# Altium project UGS_System.PrjPcb
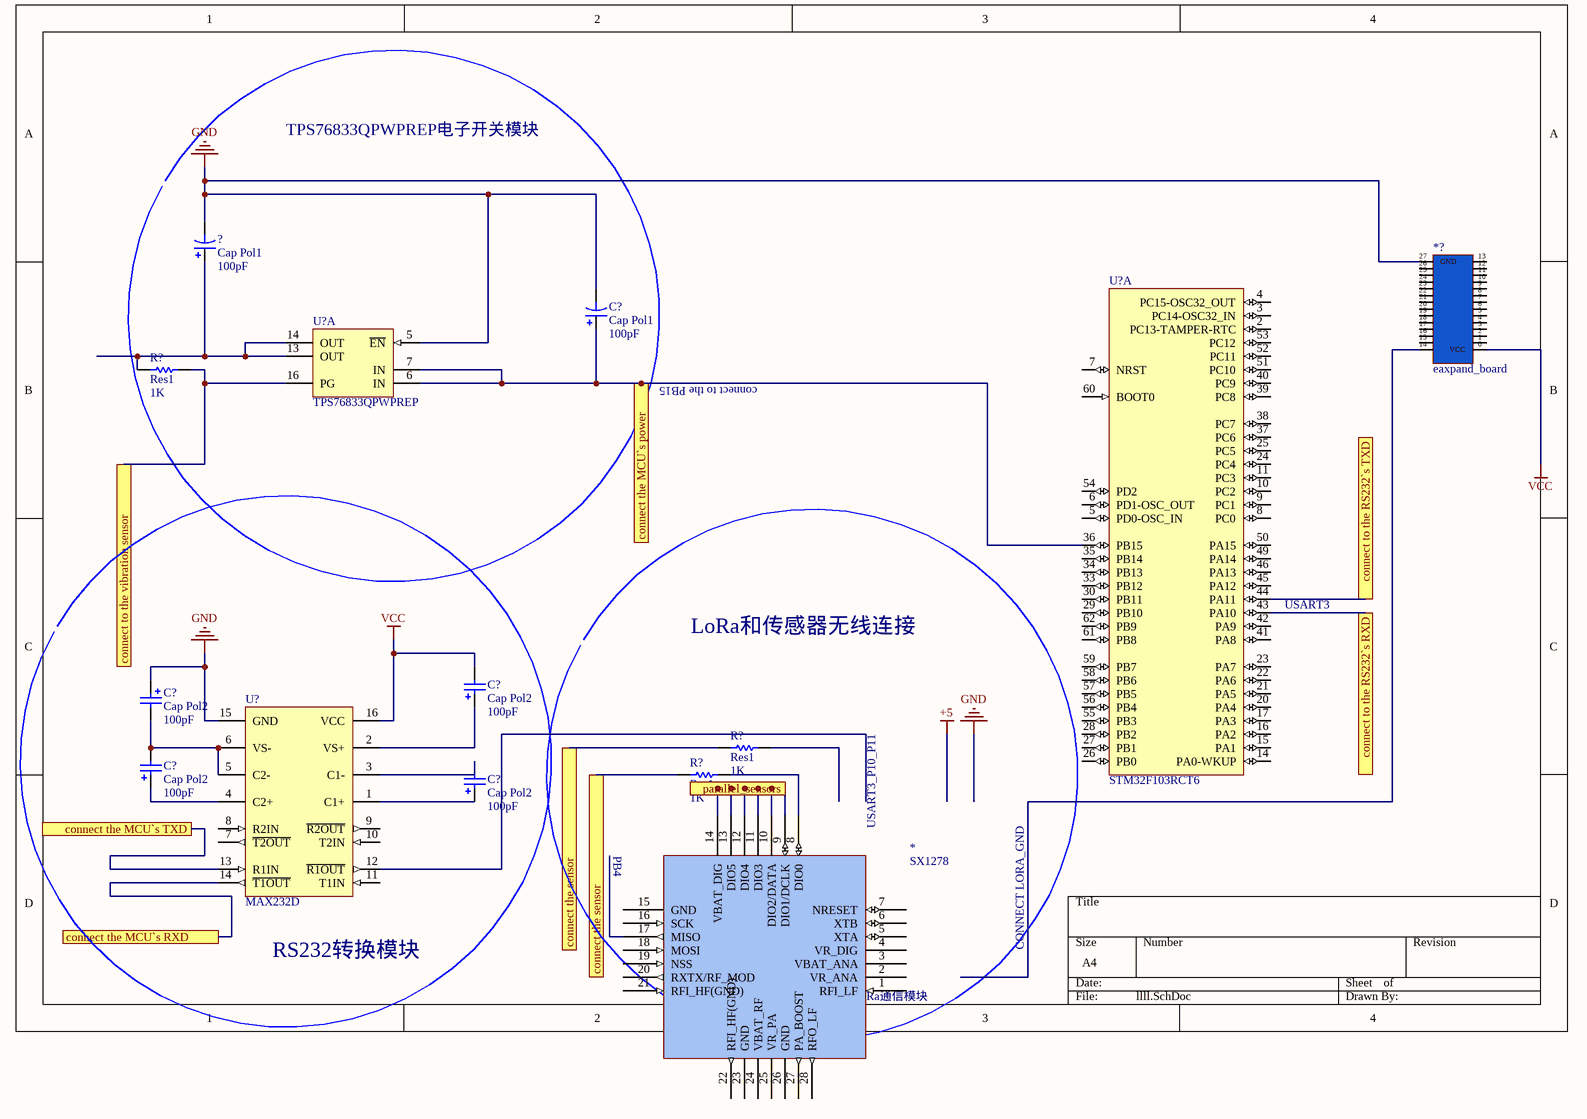
[diagram p0: llll.SchDoc]
2 sheets, 24 parts. Net scope: flat (ports and power ports of the same name join across sheets).
Board file: zhendong_sensor.PcbDoc
Sheets:
  llll.SchDoc
  transform.SchDoc

## Sheet llll.SchDoc
size A4

### Parts
(Parts that share a designator on the sheet are numbered #1, #2 ... from top to bottom, then left to right.)
*  SX1278
*?  eaxpand_board  [expand_board]
?  Cap Pol1  value 100pF  [RB7.6-15]
C?#1  Cap Pol1  value 100pF  [RB7.6-15]
C?#2  Cap Pol2  value 100pF  [POLAR0.8]
C?#3  Cap Pol2  value 100pF  [POLAR0.8]
C?#4  Cap Pol2  value 100pF  [POLAR0.8]
C?#5  Cap Pol2  value 100pF  [POLAR0.8]
R?#1  Res1  value 1K  [AXIAL-0.3]
R?#2  Res1  value 1K  [AXIAL-0.3]
R?#3  Res1  value 1K  [AXIAL-0.3]
U?#1  TPS76833QPWPREP  [TI-PWP20-2980X2000TP_N]  (part A of 3)
U?#2  STM32F103RCT6  [STM-LQFP64_N]  (part A of 2)
U?#3  MAX232D  [TI-D16_N]

### Ports
connect the MCU`s power, connect the MCU`s RXD, connect the MCU`s TXD, connect the sensor, connect to the RS232`s RXD, connect to the RS232`s TXD, connect to the vibration sensor, parallel_sensors

### Nets
GND: *?.27(GND) ?.2 C?#1.2 C?#2.1 U?#1.5(~{EN}) U?#3.15(GND)
VCC: *?.0(VCC) C?#3.2 U?#3.16(VCC)
Net*_8: *.8(DIO0) R?#3.2
Net*_9: *.9(DIO1/DCLK) ; port parallel_sensors
Net?_1: ?.1 R?#1.1 U?#1.13(OUT) U?#1.14(OUT)
NetC?#1_1: C?#1.1 U?#1.6(IN) U?#1.7(IN) U?#2.36(PB15) ; port connect the MCU`s power
NetC?#2_2: C?#2.2 C?#4.2 U?#3.5(C2-) U?#3.6(VS-)
NetC?#3_1: C?#3.1 U?#3.2(VS+)
NetC?#4_1: C?#4.1 U?#3.4(C2+)
NetC?#5_1: C?#5.1 U?#3.1(C1+)
NetC?#5_2: C?#5.2 U?#3.3(C1-)
NetR?#1_2: R?#1.2 U?#1.16(PG) ; port connect to the vibration sensor
NetR?#2_1: R?#2.1 R?#3.1 ; port connect the sensor
NetU?#2_43: U?#2.43(PA10) ; port connect to the RS232`s RXD
NetU?#2_44: U?#2.44(PA11) ; port connect to the RS232`s TXD
NetU?#3_13: U?#3.13(R1IN) ; port connect the MCU`s TXD
NetU?#3_14: U?#3.14(~{T1OUT}) ; port connect the MCU`s RXD

Not connected (* = marked no-connect by the designer): * 1(RFI_LF) 2(VR_ANA) 3(VBAT_ANA) 4(VR_DIG) 5(XTA) 6(XTB) 7(NRESET) 10(DIO2/DATA) 11(DIO3) 12(DIO4) 13(DIO5) 14(VBAT_DIG) 15(GND) 16(SCK) 17(MISO) 18(MOSI) 19(NSS) 20(RXTX/RF_MOD) 21(RFI_HF(GND)) 22(RFI_HF(GND)) 23(GND) 24(VBAT_RF) 25(VR_PA) 26(GND) 27(PA_BOOST) 28(RFO_LF); *? 1 2 3 4 5(\) 6 7 8 9 10 11 12 13 14 15 16 17 18 19 20 21 22 23 24 25 26; R?#2 2; U?#2 2(PC13-TAMPER-RTC) 3(PC14-OSC32_IN) 4(PC15-OSC32_OUT) 5(PD0-OSC_IN) 6(PD1-OSC_OUT) 7(NRST) 8(PC0) 9(PC1) 10(PC2) 11(PC3) 14(PA0-WKUP) 15(PA1) 16(PA2) 17(PA3) 20(PA4) 21(PA5) 22(PA6) 23(PA7) 24(PC4) 25(PC5) 26(PB0) 27(PB1) 28(PB2) 29(PB10) 30(PB11) 33(PB12) 34(PB13) 35(PB14) 37(PC6) 38(PC7) 39(PC8) 40(PC9) 41(PA8) 42(PA9) 45(PA12) 46(PA13) 49(PA14) 50(PA15) 51(PC10) 52(PC11) 53(PC12) 54(PD2) 55(PB3) 56(PB4) 57(PB5) 58(PB6) 59(PB7) 60(BOOT0) 61(PB8) 62(PB9); U?#3 7(~{T2OUT}) 8(R2IN) 9(~{R2OUT}) 10(T2IN) 11(T1IN) 12(~{R1OUT})

### Notes on the sheet
- TPS76833QPWPREP电子开关模块
- connect to the PB15
- LoRa和传感器无线连接
- (near U?#2) USART3
- (near *) PB4
- (near *) USART3_P10_P11
- RS232转换模块
- CONNECT LORA_GND
- (near *) LoRa通信模块

### Library data of the parts
* = SX1278: LORA
? C?#1 = Cap Pol1: Polarized Capacitor (Radial); Published: 8-Jun-2000; LatestRevisionDate: 17-Jul-2002; LatestRevisionNote: Re-released for DXP Platform.; PackageReference: RB7.6-15; Publisher: Altium Limited; PackageDescription: Polarized Capacitor (Radial); 2 Leads
C?#2-C?#5 = Cap Pol2: Polarized Capacitor (Axial); Published: 8-Jun-2000; LatestRevisionDate: 17-Jul-2002; LatestRevisionNote: Re-released for DXP Platform.; PackageReference: POLAR0.8; Publisher: Altium Limited; PackageDescription: Polarized Capacitor; 2 Leads
R?#1-R?#3 = Res1: Resistor; Published: 8-Jun-2000; LatestRevisionDate: 17-Jul-2002; LatestRevisionNote: Re-released for DXP Platform.; PackageReference: AXIAL-0.3; Publisher: Altium Limited; PackageDescription: Axial Device, Thru-Hole; 2 Leads; 0.3 in Pin Spacing
U?#1 = TPS76833QPWPREP: Single Output Fast Transient Response LDO, 1 A, Fixed 3.3 V Output, 2.7 to 10 V Input, 20-pin HTSSOP (PWP), -40 to 125 degC, Green (RoHS & no Sb/Br); Manufacturer: Texas Instruments; Accuracy(%): 2; Fixed Output Options(V): 3.3; Iout(Max)(A): 1; Iq(Typ)(mA): 0.08; Power Good: TRUE; SubFamily: Single Channel LDO; Vdo(Typ)(mV): 350; Vin(Max)(V): 10; Vin(Min)(V): 2.7; DatasheetVersion: SGLS011B; PackageVersion: 4073225-4/I; PackageReference: PWP20-2980X2000TP; PackageDescription: 20-Pin Plastic Small Outline, Body 4.4 x 6.5 mm, Pitch 0.65 mm; Supplier 1: Digi-Key; Supplier Part Number 1: 296-21901-2-ND; Supplier 2: Digi-Key; Supplier Part Number 2: 296-21901-1-ND; Supplier 3: Digi-Key; Supplier Part Number 3: 296-21901-6-ND; Supplier 4: Newark; Supplier Part Number 4: 46M1185; Supplier 5: Mouser; Supplier Part Number 5: 595-TPS76833QPWPREP; Eco-Plan: Green (RoHS & no Sb/Br); Vout Adj(Max)(V): 3.3; Vout Adj(Min)(V): 3.3; Mounting Technology: Surface Mount; Code_JEDEC: MO-153; PartNumber: TPS76833QPWPREP; ComponentLink1Description: Manufacturer URL; ComponentLink1URL: http://www.ti.com/; ComponentLink2Description: Datasheet; ComponentLink2URL: http://www.ti.com/general/docs/lit/getliterature.tsp?genericPartNumber=TPS76833-EP&fileType=pdf; ComponentLink3Description: Package Specification; ComponentLink3URL: http://www.ti.com/litv/pdf/mhts001g
U?#2 = STM32F103RCT6: ARM Cortex-M3 32-bit MCU, 256 KB Flash, 48 KB Internal RAM, 51 I/Os, 64-pin LQFP, -40 to 85 degC, Tray; A/D Converter: 3x12-bit (16 Channel); D/A Converter: 2x12-bit (2 Channel); FLASH Size (Prog) (kB): 256; I/Os (High Current): 51; Internal RAM Size (kB): 48; Operating Frequency(F) (Processor speed) (MHz): 72; Supply Voltage(Vcc) min (V): 2; DatasheetVersion: Rev. 8; PackageVersion: Rev. 4, 06/2013; PackageReference: LQFP64; PackageDescription: 64-Pin Low Profile Quad Flat Package, 10 x 10 mm Body, 0.5 mm Pitch; Supplier 1: Digi-Key; Supplier Part Number 1: 497-9033-ND; Supplier 2: Newark; Supplier Part Number 2: 01P4099; Supplier 3: Newark; Supplier Part Number 3: 57P1227; Supplier 4: Mouser; Supplier Part Number 4: 511-STM32F103RCT6; Core: ARM Cortex-M3; Packing: Tray; Mounting Technology: Surface Mount; PartNumber: STM32F103RCT6; ComponentLink1Description: Manufacturer URL; ComponentLink1URL: http://www.st.com/web/en/home.html; ComponentLink2Description: Datasheet; ComponentLink2URL: http://www.st.com/st-web-ui/static/active/en/resource/technical/document/datasheet/CD00191185.pdf; ComponentLink3Description: Package Specification; ComponentLink3URL: http://www.st.com/st-web-ui/static/active/en/resource/technical/document/datasheet/DM00037051.pdf
U?#3 = MAX232D: Dual EIA-232 Driver / Receiver, 0 to 70 degC, 16-Pin SOIC (D), Green (RoHS & no Sb/Br); SubFamily: RS-232; Drivers Per Package: 2; Supply Voltage(s)(V): 5; ESD HBM(kV): +/-2; ICC(Max)(mA): 10; Single Supply: TRUE; DatasheetVersion: SLLS047L; PackageVersion: revM, Jun-2011; PackageReference: D16; PackageDescription: 16-Pin Plastic Small Outline Integrated Circuit, 9.9 x 3.9 mm, Pitch 1.27 mm Pitch; Receivers Per Package: 2; RS-232: TRUE; ComponentLink1Description: Manufacturer URL; ComponentLink1URL: www.ti.com; ComponentLink2Description: Datasheet; ComponentLink2URL: http://www.ti.com/general/docs/lit/getliterature.tsp?genericPartNumber=MAX232&fileType=pdf; ComponentLink3Description: Package Specification; ComponentLink3URL: http://www.ti.com/litv/pdf/mpds178g

## Sheet transform.SchDoc
size A4
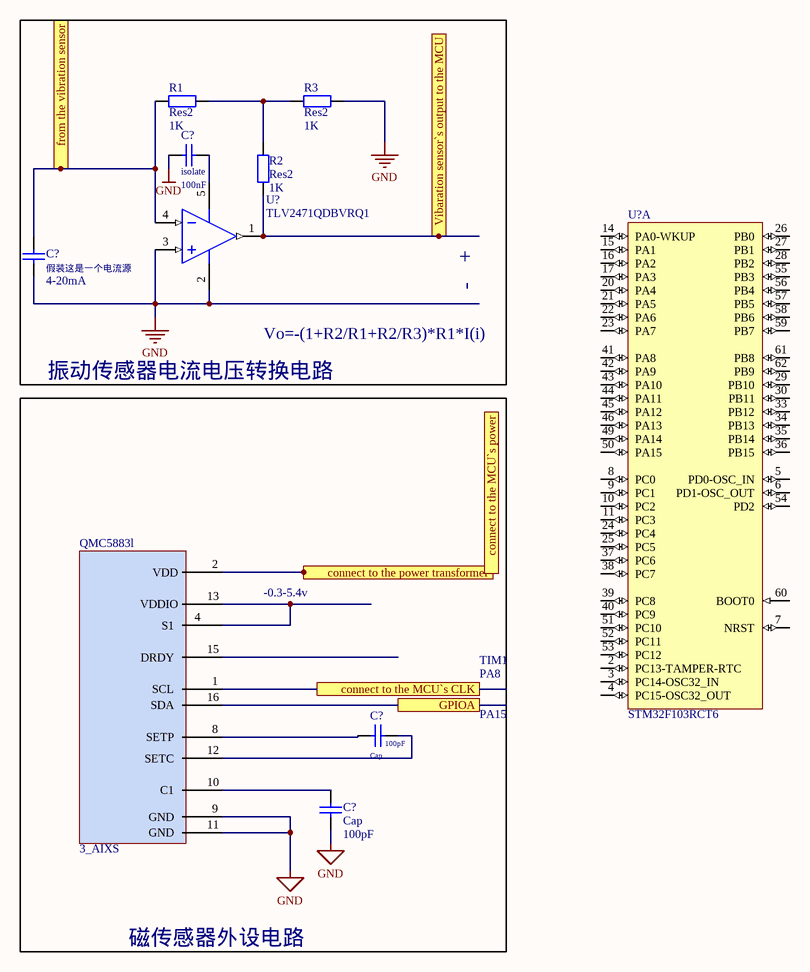
[diagram p1: transform.SchDoc]

### Parts
(Parts that share a designator on the sheet are numbered #1, #2 ... from top to bottom, then left to right.)
C?#6  isolate  value 100nF  [RAD-0.3]
C?#7  假装这是一个电流源  value 4-20mA  [RAD-0.3]
C?#8  Cap  value 100pF  [RAD-0.3]
C?#9  Cap  value 100pF  [RAD-0.3]
QMC5883l  3_AIXS
R1  Res2  value 1K  [AXIAL-0.4]
R2  Res2  value 1K  [AXIAL-0.4]
R3  Res2  value 1K  [AXIAL-0.4]
U?#4  TLV2471QDBVRQ1  [TI-DBV5_N]
U?#5  STM32F103RCT6  [STM-LQFP64_N]  (part A of 2)

### Ports
connect to the MCU`s CLK, connect to the MCU`s power, connect to the power transformer, from the vibration sensor, GPIOA, Vibaration sensor`s output to the MCU

### Nets
GND: C?#6.2 C?#7.1 C?#9.1 QMC5883l.9(GND) QMC5883l.11(GND) R3.1 U?#4.2(GND) U?#4.3(IN+)
NetC?#6_1: C?#6.1 U?#4.5(VDD)
NetC?#7_2: C?#7.2 R1.1 U?#4.4(IN-) ; port from the vibration sensor
NetC?#8_1: C?#8.1 QMC5883l.12(SETC)
NetC?#8_2: C?#8.2 QMC5883l.8(SETP)
NetC?#9_2: C?#9.2 QMC5883l.10(C1)
NetQMC5883l_1: QMC5883l.1(SCL) ; port connect to the MCU`s CLK
NetQMC5883l_2: QMC5883l.2(VDD) ; port connect to the power transformer
NetQMC5883l_4: QMC5883l.4(S1) QMC5883l.13(VDDIO)
NetQMC5883l_16: QMC5883l.16(SDA) ; port GPIOA
NetR1_2: R1.2 R2.2 R3.2
NetR2_1: R2.1 U?#4.1(OUT) ; port Vibaration sensor`s output to the MCU

Not connected (* = marked no-connect by the designer): QMC5883l 15(DRDY); U?#5 2(PC13-TAMPER-RTC) 3(PC14-OSC32_IN) 4(PC15-OSC32_OUT) 5(PD0-OSC_IN) 6(PD1-OSC_OUT) 7(NRST) 8(PC0) 9(PC1) 10(PC2) 11(PC3) 14(PA0-WKUP) 15(PA1) 16(PA2) 17(PA3) 20(PA4) 21(PA5) 22(PA6) 23(PA7) 24(PC4) 25(PC5) 26(PB0) 27(PB1) 28(PB2) 29(PB10) 30(PB11) 33(PB12) 34(PB13) 35(PB14) 36(PB15) 37(PC6) 38(PC7) 39(PC8) 40(PC9) 41(PA8) 42(PA9) 43(PA10) 44(PA11) 45(PA12) 46(PA13) 49(PA14) 50(PA15) 51(PC10) 52(PC11) 53(PC12) 54(PD2) 55(PB3) 56(PB4) 57(PB5) 58(PB6) 59(PB7) 60(BOOT0) 61(PB8) 62(PB9)

### Notes on the sheet
- +
- -
- Vo=-(1+R2/R1+R2/R3)*R1*I(i)
- 振动传感器电流电压转换电路
- -0.3-5.4v
- TIM1
- PA8
- PA15
- 磁传感器外设电路

### Library data of the parts
C?#6-C?#9 = Cap: Capacitor; Published: 8-Jun-2000; LatestRevisionDate: 17-Jul-2002; LatestRevisionNote: Re-released for DXP Platform.; PackageReference: RAD-0.3; Publisher: Altium Limited; PackageDescription: Radial Cap, Thru-Hole; 2 Leads; 0.3 in Pin Spacing
QMC5883l = QMC5883L
R1-R3 = Res2: Resistor; Published: 8-Jun-2000; LatestRevisionDate: 17-Jul-2002; LatestRevisionNote: Re-released for DXP Platform.; PackageReference: AXIAL-0.4; Publisher: Altium Limited; PackageDescription: Axial Device, Thru-Hole; 2 Leads; 0.4 in Pin Spacing
U?#4 = TLV2471QDBVRQ1: Automotive Catalog 600 uA/Ch 2.8 MHz Rail-to-Rail Input / Output High-Drive Operational Amplifier, 2.7 to 6 V, -40 to 125 degC, 5-pin SOT23 (DBV5), Green (RoHS & no Sb/Br); Manufacturer: Texas Instruments; CMRR(Min)(dB): 58; GBW(Typ)(MHz): 2.8; IIB(Max)(pA): 50; Iq per channel(Max)(mA): 0.75; Number of Channels: 1; Offset Drift(Typ)(uV/C): 0.4; Packing: LARGE T&R; Slew Rate(Typ)(V/us): 1.4; Sub Family: Low Supply Voltage Amplifier (<=2.7V), Precision Amplifier; Total Supply Voltage(Max)(+5V is 5, +/-5V is 10): 6; Total Supply Voltage(Min)(+5V is 5, +/-5V is 10): 2.7; Vio (25C)(Max)(mV): 2.2; DatasheetVersion: SGLS180B; PackageVersion: 4073253-4/K, 03/2006; PackageReference: DBV5; PackageDescription: 5-Pin Plastic Small Outline, Body 1.6 x 2.9 mm, Pitch 0.95 mm; Eco-Plan: Green (RoHS & no Sb/Br); Rating: Automotive; Mounting Technology: Surface Mount; Code_JEDEC: MO-178; PartNumber: TLV2471QDBVRQ1; ComponentLink1Description: Manufacturer URL; ComponentLink1URL: http://www.ti.com/; ComponentLink2Description: Datasheet; ComponentLink2URL: http://www.ti.com/lit/ds/symlink/tlv2471-q1.pdf; ComponentLink3Description: Package Specification; ComponentLink3URL: http://www.ti.com/litv/pdf/mpds018i
U?#5 = STM32F103RCT6: as U?#2 on sheet llll; DatasheetVersion: Rev. 8; PackageVersion: Rev. 4, 06/2013; PackageReference: LQFP64; PackageDescription: 64-Pin Low Profile Quad Flat Package, 10 x 10 mm Body, 0.5 mm Pitch; Supplier 1: Digi-Key; Supplier Part Number 1: 497-9033-ND; Supplier 2: Newark; Supplier Part Number 2: 01P4099; Supplier 3: Newark; Supplier Part Number 3: 57P1227; Supplier 4: Mouser; Supplier Part Number 4: 511-STM32F103RCT6; Core: ARM Cortex-M3; Packing: Tray; Mounting Technology: Surface Mount; PartNumber: STM32F103RCT6; ComponentLink1Description: Manufacturer URL; ComponentLink1URL: http://www.st.com/web/en/home.html; ComponentLink2Description: Datasheet; ComponentLink2URL: http://www.st.com/st-web-ui/static/active/en/resource/technical/document/datasheet/CD00191185.pdf; ComponentLink3Description: Package Specification; ComponentLink3URL: http://www.st.com/st-web-ui/static/active/en/resource/technical/document/datasheet/DM00037051.pdf

## Nets that join several sheets
GND: llll (6 pins), transform (8 pins)